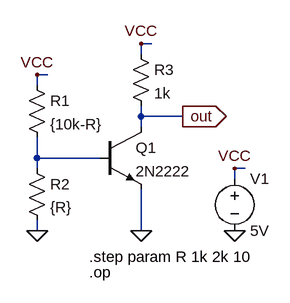
[diagram p0: schematic param.asc]
param.asc, the LTspice schematic file:
Version 4
SHEET 1 880 680
WIRE 240 0 224 0
WIRE 224 16 224 0
WIRE 80 48 64 48
WIRE 64 64 64 48
WIRE 224 112 224 96
WIRE 288 112 224 112
WIRE 224 128 224 112
WIRE 64 176 64 144
WIRE 160 176 64 176
WIRE 64 192 64 176
WIRE 384 192 368 192
WIRE 368 208 368 192
WIRE 64 288 64 272
WIRE 224 288 224 224
FLAG 224 288 0
FLAG 224 0 VCC
FLAG 64 288 0
FLAG 64 48 VCC
FLAG 288 112 out
IOPIN 288 112 Out
FLAG 368 288 0
FLAG 368 192 VCC
SYMBOL npn 160 128 R0
SYMATTR InstName Q1
SYMATTR Value 2N2222
SYMBOL res 48 48 R0
SYMATTR InstName R1
SYMATTR Value {10k-R}
SYMBOL res 48 176 R0
SYMATTR InstName R2
SYMATTR Value {R}
SYMBOL res 208 0 R0
SYMATTR InstName R3
SYMATTR Value 1k
SYMBOL voltage 368 192 R0
WINDOW 123 0 0 Left 0
WINDOW 39 0 0 Left 0
SYMATTR InstName V1
SYMATTR Value 5V
TEXT 144 328 Left 0 !.step param R 1k 2k 10
TEXT 144 352 Left 0 !.op

The netlist it stands for:
* param.asc
Q1 out N001 0 0 2N2222
R1 VCC N001 {10k-R}
R2 N001 0 {R}
R3 VCC out 1k
V1 VCC 0 5V
.model NPN NPN
.model PNP PNP
.lib standard.bjt
.step param R 1k 2k 10
.op
.backanno
.end